# Altium schematic sheet ResistorBoard.SchDoc
size A
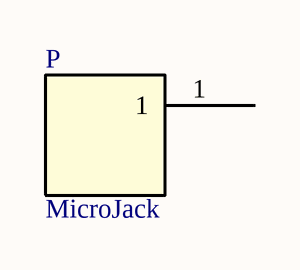
[diagram p0: ResistorBoard.SchDoc]

## Parts
P  MicroJack  [MicroJack_1682 - 24 times]

## Nets

Not connected (* = marked no-connect by the designer): P 1